# Altium project Fri3D_IRA_02.PrjPcb
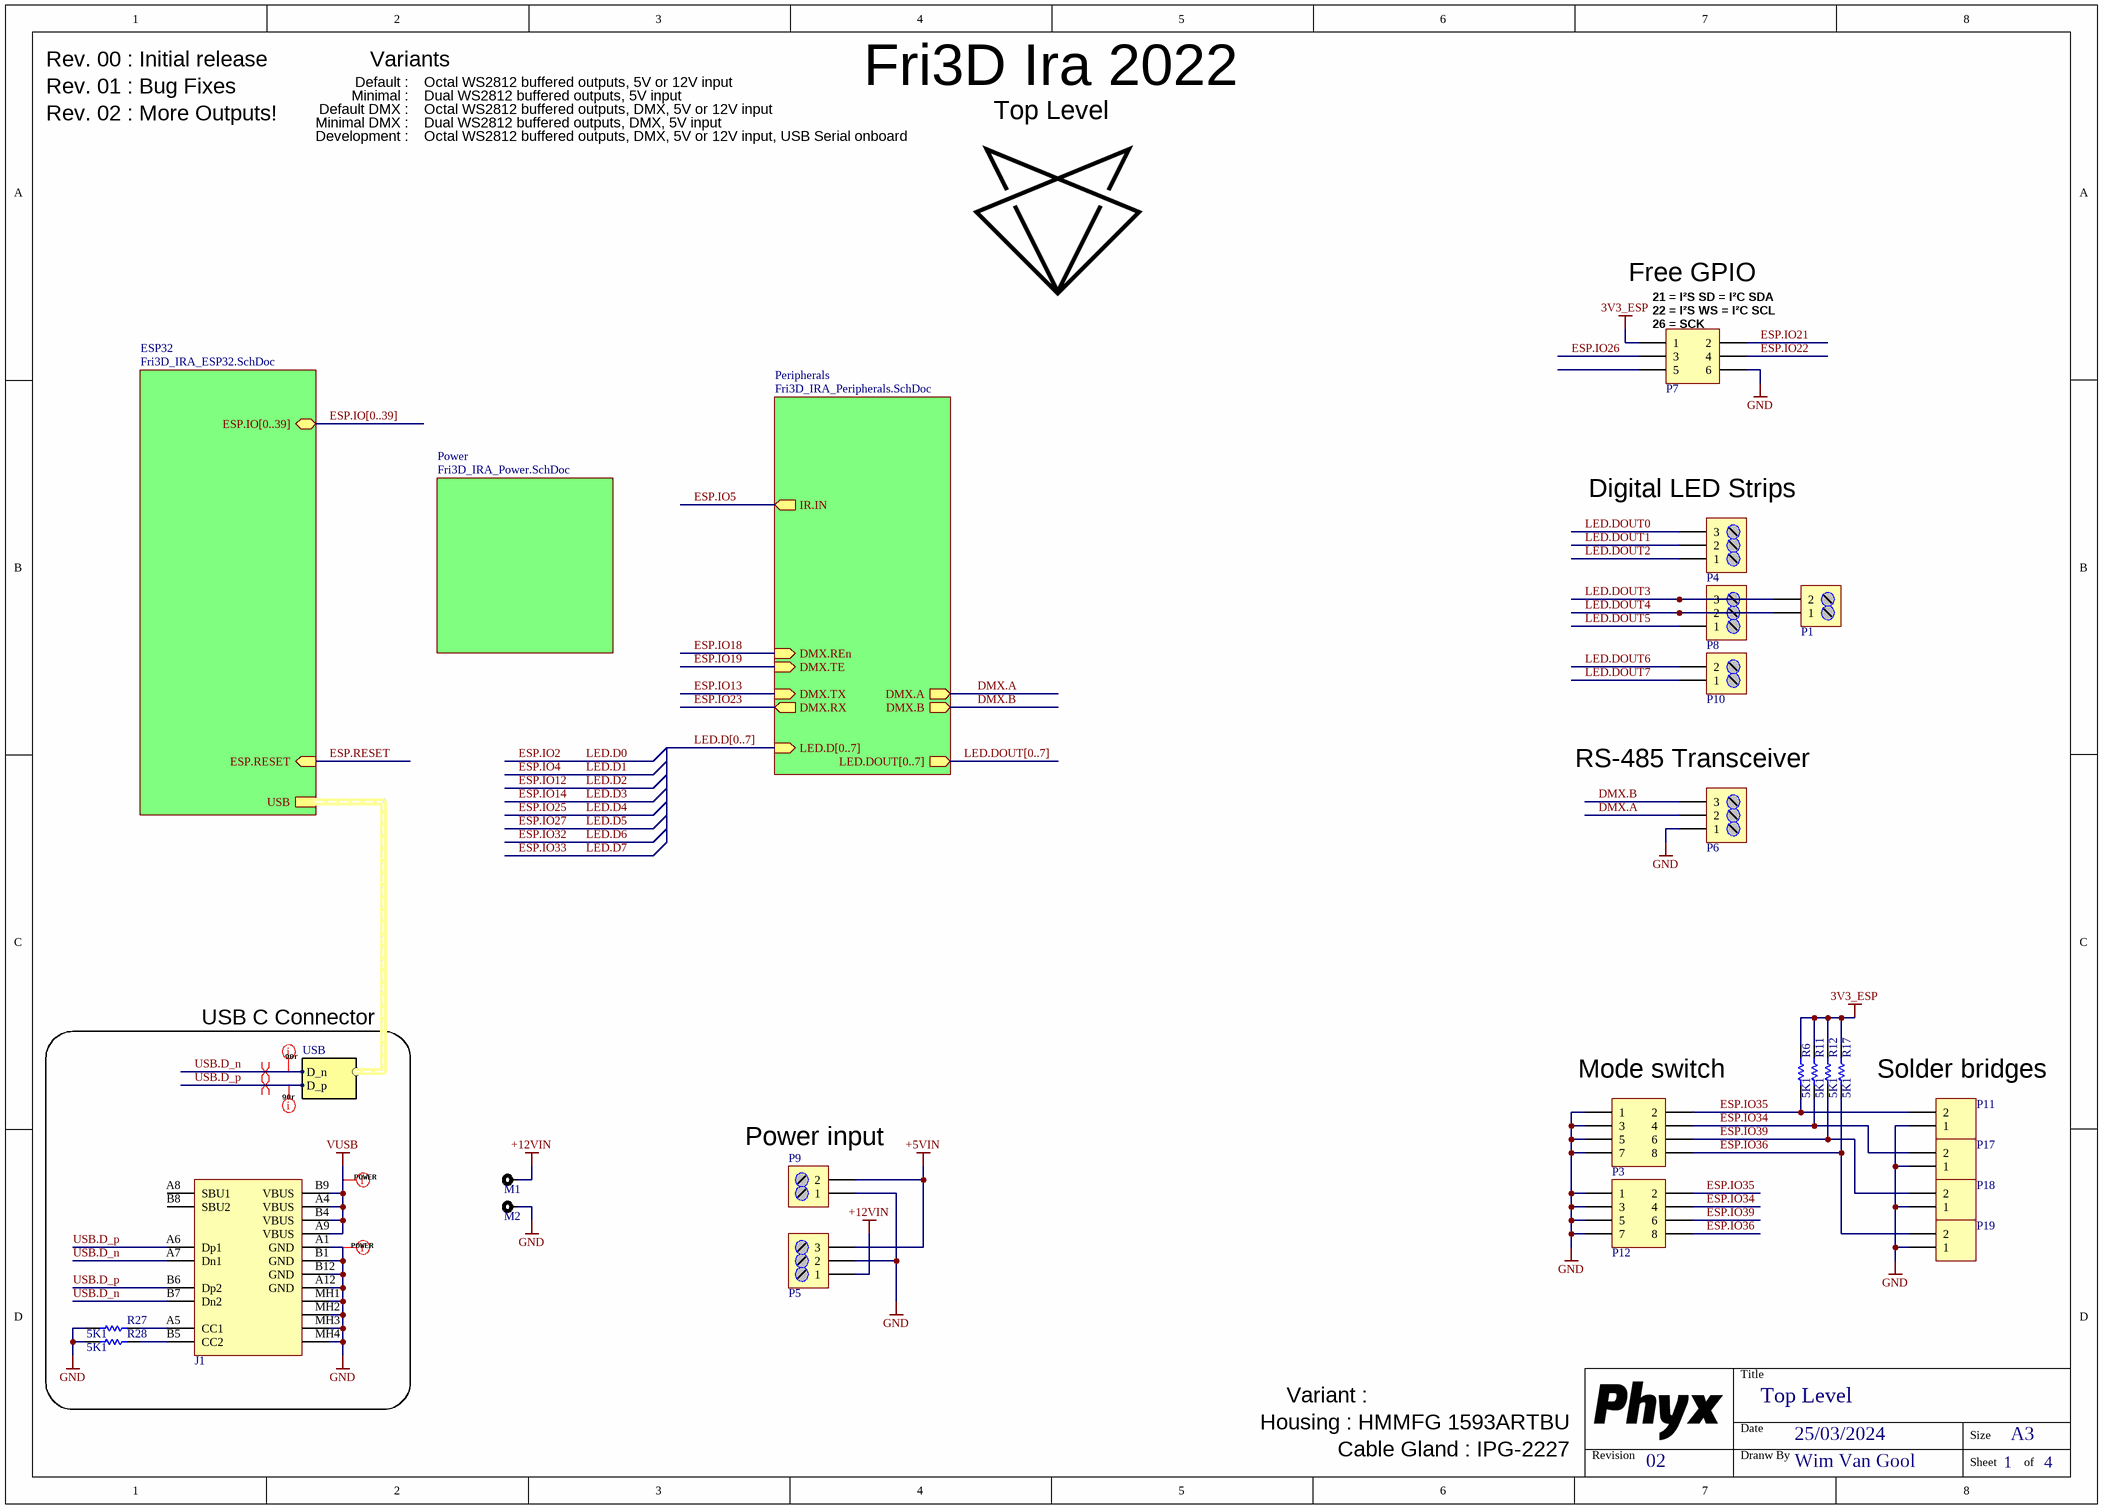
[diagram p0: Fri3D_IRA_02.SchDoc]
PCB_ENGINEER: WimVG; PCB_REV: 02; PCB_TITLE: Fri3D Ira 2022
4 sheets, 98 parts. Net scope: hierarchical (ports join the sheet entries above them; power ports are global).
Board file: Fri3D_IRA_02.PcbDoc
Sheets:
  Fri3D_IRA_02.SchDoc
    Peripherals = Fri3D_IRA_Peripherals.SchDoc
    Power = Fri3D_IRA_Power.SchDoc
    ESP32 = Fri3D_IRA_ESP32.SchDoc

## Sheet Fri3D_IRA_02.SchDoc: Top Level
size A3; Date: 25/03/2024; DrawnBy: Wim Van Gool; DocumentNumber: 1; Revision: 02; SheetNumber: 1; SheetTotal: 4

### Parts
J1  USB 2.0 C Reversible Receptacle Horizontal  [HRO_TYPE-C-31-M-12]  (value not drawn)
M1  SMD Spacer 1mm M3 Internal Thread  [WE_9774010360]  (value not drawn)
M2  SMD Spacer 1mm M3 Internal Thread  [WE_9774010360]  (value not drawn)
P1  2 Way Screw HDR 3.5mm Rising Cage  [WE_691103110002]  (value not drawn)
P3  Header 4x2  [HDR2X4]  (value not drawn)
P4  3 Way Screw HDR 3.5mm Rising Cage  [WE_691103110003]  (value not drawn)
P5  3 Way Screw HDR 5,08mm  [TERM_BLK-0508-3-90]  (value not drawn)
P6  3 Way Screw HDR 3.5mm Rising Cage  [WE_691103110003]  (value not drawn)
P7  Header 3X2  [HDR2X3]  (value not drawn)
P8  3 Way Screw HDR 3.5mm Rising Cage  [WE_691103110003]  (value not drawn)
P9  2 Way Screw HDR 5,08mm  [TERM_BLK-0508-2-90]  (value not drawn)
P10  2 Way Screw HDR 3.5mm Rising Cage  [WE_691103110002]  (value not drawn)
P11  Easy to solder connection  [SOLDER_SW_V_1MM]  (value not drawn)
P12  Header 4X2  [HDR2X4_SMD]  (value not drawn)
P17  Easy to solder connection  [SOLDER_SW_V_1MM]  (value not drawn)
P18  Easy to solder connection  [SOLDER_SW_V_1MM]  (value not drawn)
P19  Easy to solder connection  [SOLDER_SW_V_1MM]  (value not drawn)
R6  value 5K1  [R0603_N]
R11  value 5K1  [R0603_N]
R12  value 5K1  [R0603_N]
R17  value 5K1  [R0603_N]
R27  value 5K1  [R0603_N]
R28  value 5K1  [R0603_N]

### Blocks framed on the sheet
USB C Connector: J1 R27 R28

### Sub-sheets
ESP32 = Fri3D_IRA_ESP32.SchDoc: ESP.RESET (in), ESP.IO[0..39] (bidir), USB (harness USB)
Peripherals = Fri3D_IRA_Peripherals.SchDoc: IR.IN (out), DMX.RX (out), DMX.A (out), DMX.B (out), DMX.TX (in), DMX.REn (in), DMX.TE (in), LED.D[0..7] (in), LED.DOUT[0..7] (out)
Power = Fri3D_IRA_Power.SchDoc: no entries

### Harnesses
USB: D_p, D_n

### Nets
3V3_ESP: P7.1 R6.1 R11.1 R12.1 R17.1
+5VIN: P5.3 P9.2
+12VIN: M1.1 P5.1
GND: J1.A1(GND) J1.A12(GND) J1.B1(GND) J1.B12(GND) J1.MH1(Tab) J1.MH2(Tab) J1.MH3(Tab) J1.MH4(Tab) M2.1 P3.1 P3.3 P3.5 P3.7 P5.2 P6.1 P7.6 P9.1 P11.1 P12.1 P12.3 P12.5 P12.7 P17.1 P18.1 P19.1 R27.2 R28.2
VUSB: J1.A4(VBUS) J1.A9(VBUS) J1.B4(VBUS) J1.B9(VBUS)
DMX.A: P6.2 ; sheet Peripherals/DMX.A
DMX.B: P6.3 ; sheet Peripherals/DMX.B
ESP.IO21: P7.2
ESP.IO22: P7.4
ESP.IO26: P7.3
ESP.IO34: P3.4 P12.4 P17.2 R11.2
ESP.IO35: P3.2 P11.2 P12.2 R6.2
ESP.IO36: P3.8 P12.8 P19.2 R17.2
ESP.IO39: P3.6 P12.6 P18.2 R12.2
LED.DOUT0: P4.3
LED.DOUT1: P4.2
LED.DOUT2: P4.1
LED.DOUT3: P1.2 P8.3
LED.DOUT4: P1.1 P8.2
LED.DOUT5: P8.1
LED.DOUT6: P10.2
LED.DOUT7: P10.1
USB.D_n: J1.A7(Dn1) J1.B7(Dn2) ; sheet ESP32/USB.D_n
USB.D_p: J1.A6(Dp1) J1.B6(Dp2) ; sheet ESP32/USB.D_p
NetJ1_A5: J1.A5(CC1) R27.1
NetJ1_B5: J1.B5(CC2) R28.1

Not connected (* = marked no-connect by the designer): J1 A8(SBU1) B8(SBU2); P7 5

### Buses and harness runs
bus ESP.IO[0..39] = sheet ESP32/ESP.IO[0..39]
bus LED.D[0..7] = sheet Peripherals/LED.D[0..7]
bus LED.DOUT[0..7] = sheet Peripherals/LED.DOUT[0..7]

### Layout directives
net class 90r: USB.D_n, USB.D_p
differential pair: USB.D_n, USB.D_p
net class POWER: GND, VUSB

### Notes on the sheet
- Rev. 00 : Initial release
- Variants
- Rev. 01 : Bug Fixes
- Rev. 02 : More Outputs!
- Default :
- Minimal :
- Minimal DMX :
- Default DMX :
- Octal WS2812 buffered outputs, 5V or 12V input
- Dual WS2812 buffered outputs, 5V input
- Dual WS2812 buffered outputs, DMX, 5V input
- Octal WS2812 buffered outputs, DMX, 5V or 12V input
- Development :
- Octal WS2812 buffered outputs, DMX, 5V or 12V input, USB Serial onboard
- (near P7) 22 = I²S WS = I²C SCL
- (near P7) 26 = SCK
- (near P7) 21 = I²S SD = I²C SDA
- Free GPIO
- (near P4) Digital LED Strips
- (near P6) RS-485 Transceiver
- (near P3) Mode switch
- Solder bridges
- (near P9) Power input
- Variant :
- Housing : HMMFG 1593ARTBU
- Cable Gland : IPG-2227
- Title
- Revision
- Date
- Dranw By
- Size
- A3
- Sheet
- of

### Library data of the parts
J1 = USB # C 2.0 RCPT TYPE-C-31-M-12: Value: TYPE-C-31-M-12; Supplier 1: China; Supplier Part Number 1: HRO TYPE-C-31-M-12; Supplier 2: LCSC; Supplier Part Number 2: C165948; Supplier 3: LCSC ALT; Supplier Part Number 3: C167321 / C319148
M1 M2 = SPACER # M3 1mm: Screw Hole; Value: 9774010360; Supplier 1: Wurth; Supplier Part Number 1: 9774010360
P1 P10 = Terminal Block 3.5mm 2way: Supplier 1: LCSC; Supplier Part Number 1: C784940; Supplier 2: Würth; Supplier Part Number 2: 691214110002
P3 = Pin Header 2.54mm dual row 8way
P4 P6 P8 = Terminal Block 3.5mm 3way: Supplier 1: LCSC; Supplier Part Number 1: C784941; Supplier 2: Würth; Supplier Part Number 2: 691214110003
P5 = Terminal Block 5.08mm 3way: Value: PM5.08/3/90; Supplier 1: Farnell
P7 = Pin Header 2.54mm dual row 6way
P9 = Terminal Block 5.08mm 2way: Value: PM5.08/2/90; Supplier 1: Farnell; Supplier Part Number 1: 1131853; Supplier 2: LCSC; Supplier Part Number 2: C8465
P11 P17-P19 = SOLDER SW V 1MM: Value: NO BOM
P12 = Pin Header # 2.54mm dual row 8way: Supplier 1: LCSC; Supplier Part Number 1: C192300; Description: Pin Header # 2.54mm dual row 8way
R6 R11 R12 R17 R27 R28 = RES # 5K1 0603: Supplier 1: Farnell; Supplier Part Number 1: 2845922; Supplier 2: LCSC; Supplier 3: Generic; Supplier Part Number 2: C112314; Supplier Part Number 3: 5K1 1% 0603

## Sheet Fri3D_IRA_Peripherals.SchDoc: Peripherals
size A3; Date: 25/03/2024; DrawnBy: Wim Van Gool; DocumentNumber: 3; Revision: 02; SheetNumber: 3; SheetTotal: 4
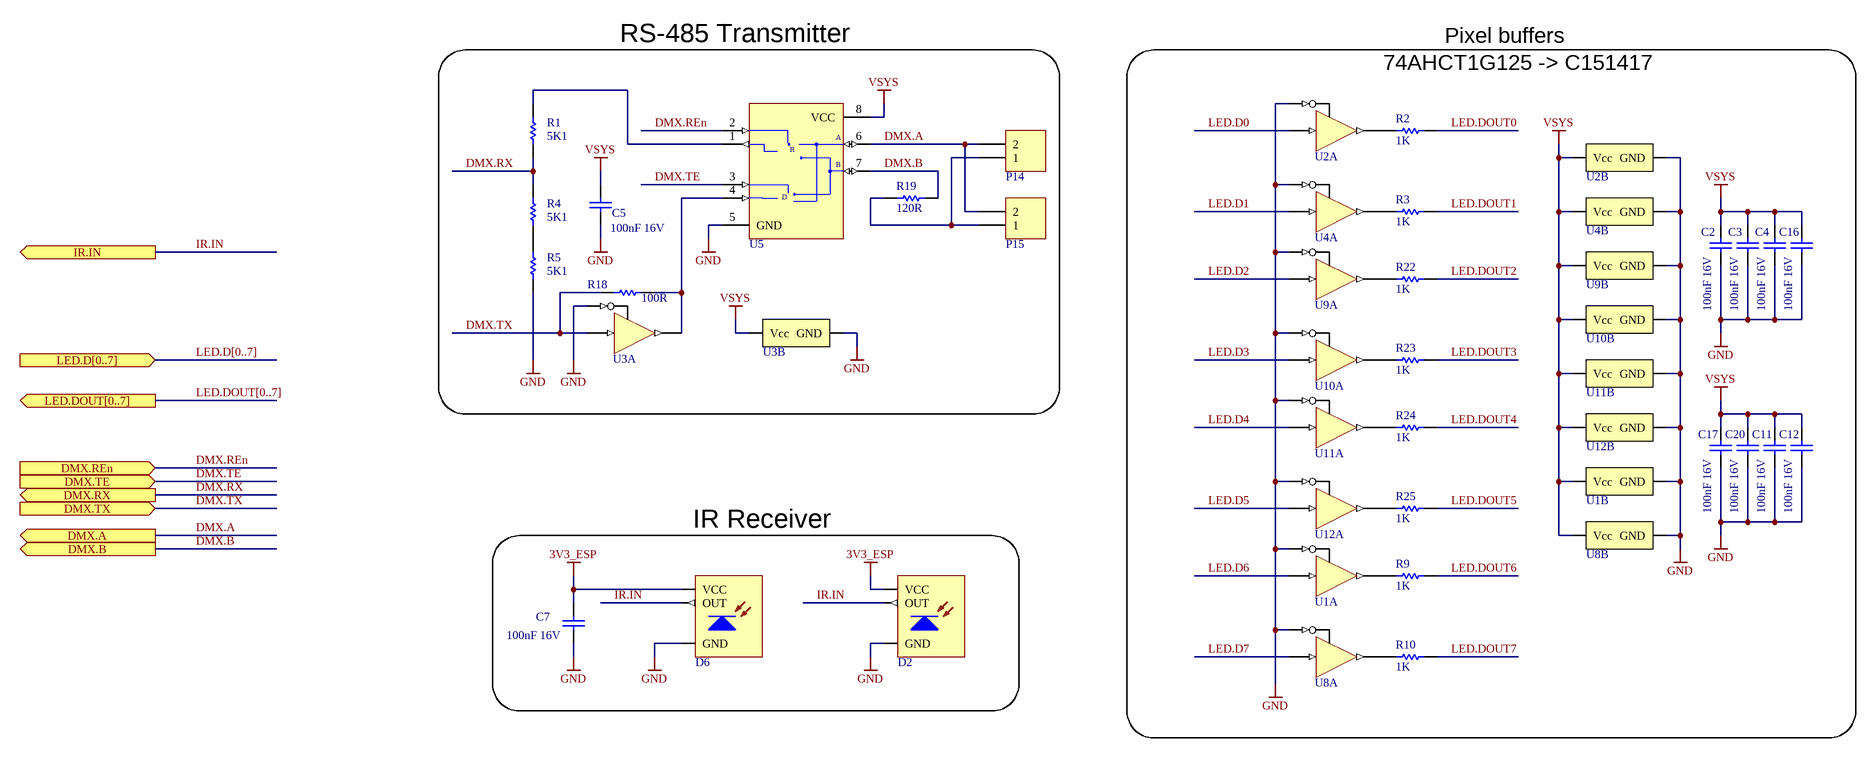
[diagram p1: Fri3D_IRA_Peripherals.SchDoc]

### Parts
C2  value 100nF 16V  [C0603_N]
C3  value 100nF 16V  [C0603_N]
C4  value 100nF 16V  [C0603_N]
C5  value 100nF 16V  [C0603_N]
C7  value 100nF 16V  [C0603_N]
C11  value 100nF 16V  [C0603_N]
C12  value 100nF 16V  [C0603_N]
C16  value 100nF 16V  [C0603_N]
C17  value 100nF 16V  [C0603_N]
C20  value 100nF 16V  [C0603_N]
D2  ZIRM-5042B-42-Z2 Infrared Receiver 38 kHz 45° 2.7-5.5V 940nm  [CHAU_ZIRM-5042B-42-Z2]  (value not drawn)
D6  IRM-3638N3F14 Infrared Receiver 38 kHz 45° 2.7-5.5V  [VIS_TSOP381x_BENT]  (value not drawn)
P14  Easy to solder connection  [SOLDER_SW_V_1MM]  (value not drawn)
P15  Header 2  [HDR1X2]  (value not drawn)
R1  value 5K1  [R0603_N]
R2  value 1K  [R0603_N]
R3  value 1K  [R0603_N]
R4  value 5K1  [R0603_N]
R5  value 5K1  [R0603_N]
R9  value 1K  [R0603_N]
R10  value 1K  [R0603_N]
R18  value 100R  [R0603_N]
R19  value 120R  [R1206]
R22  value 1K  [R0603_N]
R23  value 1K  [R0603_N]
R24  value 1K  [R0603_N]
R25  value 1K  [R0603_N]
U1  SN74AHCT1G125DCKR  Buffer, Tri-State, 4.5V to 5.5V  [TI_DCK_R-PDSO-G5]  (value not drawn)  (parts A,B of 2)
U2  SN74AHCT1G125DCKR  Buffer, Tri-State, 4.5V to 5.5V  [TI_DCK_R-PDSO-G5]  (value not drawn)  (parts A,B of 2)
U3  SN74AHCT1G125DCKR  Buffer, Tri-State, 4.5V to 5.5V  [TI_DCK_R-PDSO-G5]  (value not drawn)  (parts A,B of 2)
U4  SN74AHCT1G125DCKR  Buffer, Tri-State, 4.5V to 5.5V  [TI_DCK_R-PDSO-G5]  (value not drawn)  (parts A,B of 2)
U5  RS-485 5V Transceiver 500kbps  [SOIC_N_8]  (value not drawn)
U8  SN74AHCT1G125DCKR  Buffer, Tri-State, 4.5V to 5.5V  [TI_DCK_R-PDSO-G5]  (value not drawn)  (parts A,B of 2)
U9  SN74AHCT1G125DCKR  Buffer, Tri-State, 4.5V to 5.5V  [TI_DCK_R-PDSO-G5]  (value not drawn)  (parts A,B of 2)
U10  SN74AHCT1G125DCKR  Buffer, Tri-State, 4.5V to 5.5V  [TI_DCK_R-PDSO-G5]  (value not drawn)  (parts A,B of 2)
U11  SN74AHCT1G125DCKR  Buffer, Tri-State, 4.5V to 5.5V  [TI_DCK_R-PDSO-G5]  (value not drawn)  (parts A,B of 2)
U12  SN74AHCT1G125DCKR  Buffer, Tri-State, 4.5V to 5.5V  [TI_DCK_R-PDSO-G5]  (value not drawn)  (parts A,B of 2)

### Blocks framed on the sheet
RS-485 Transmitter: C5 P14 P15 R1 R4 R5 R18 R19 U3 U5
IR Receiver: C7 D2 D6

### Ports
DMX.A (out), DMX.B (out), DMX.REn (in), DMX.RX (out), DMX.TE (in), DMX.TX (in), IR.IN (out), LED.D[0..7] (in), LED.DOUT[0..7] (out)

### Nets
3V3_ESP: C7.1 D2.3(VCC) D6.3(VCC)
GND: C2.2 C3.2 C4.2 C5.2 C7.2 C11.2 C12.2 C16.2 C17.2 C20.2 D2.2(GND) D6.2(GND) R5.2 U1.1(~{OE}) U1.3(GND) U2.1(~{OE}) U2.3(GND) U3.1(~{OE}) U3.3(GND) U4.1(~{OE}) U4.3(GND) U5.5(GND) U8.1(~{OE}) U8.3(GND) U9.1(~{OE}) U9.3(GND) U10.1(~{OE}) U10.3(GND) U11.1(~{OE}) U11.3(GND) U12.1(~{OE}) U12.3(GND)
VSYS: C2.1 C3.1 C4.1 C5.1 C11.1 C12.1 C16.1 C17.1 C20.1 U1.5(Vcc) U2.5(Vcc) U3.5(Vcc) U4.5(Vcc) U5.8(VCC) U8.5(Vcc) U9.5(Vcc) U10.5(Vcc) U11.5(Vcc) U12.5(Vcc)
DMX.A: P14.2 P15.2 U5.6(A) ; port DMX.A
DMX.B: R19.2 U5.7(B) ; port DMX.B
DMX.REn: U5.2(~{RE}) ; port DMX.REn
DMX.RX: R1.2 R4.1 ; port DMX.RX
DMX.TE: U5.3(DE) ; port DMX.TE
DMX.TX: R18.1 U3.2(A) ; port DMX.TX
IR.IN: D2.1(OUT) D6.1(OUT) ; port IR.IN  [project net ESP.IO5]
LED.D0: U2.2(A)  [project net ESP.IO2]
LED.D1: U4.2(A)  [project net ESP.IO4]
LED.D2: U9.2(A)  [project net ESP.IO12]
LED.D3: U10.2(A)  [project net ESP.IO14]
LED.D4: U11.2(A)  [project net ESP.IO25]
LED.D5: U12.2(A)  [project net ESP.IO27]
LED.D6: U1.2(A)  [project net ESP.IO32]
LED.D7: U8.2(A)  [project net ESP.IO33]
LED.DOUT0: R2.2
LED.DOUT1: R3.2
LED.DOUT2: R22.2
LED.DOUT3: R23.2
LED.DOUT4: R24.2
LED.DOUT5: R25.2
LED.DOUT6: R9.2
LED.DOUT7: R10.2
NetP14_1: P14.1 P15.1 R19.1
NetR1_1: R1.1 U5.1(RO)
NetR2_1: R2.1 U2.4(Y)
NetR3_1: R3.1 U4.4(Y)
NetR4_2: R4.2 R5.1
NetR9_1: R9.1 U1.4(Y)
NetR10_1: R10.1 U8.4(Y)
NetR18_2: R18.2 U3.4(Y) U5.4(DI)
NetR22_1: R22.1 U9.4(Y)
NetR23_1: R23.1 U10.4(Y)
NetR24_1: R24.1 U11.4(Y)
NetR25_1: R25.1 U12.4(Y)

### Buses and harness runs
bus LED.D[0..7] = port LED.D[0..7]
bus LED.DOUT[0..7] = port LED.DOUT[0..7]

### Notes on the sheet
- Pixel buffers
- 74AHCT1G125 -> C151417
- Title
- Revision
- Date
- Dranw By
- Size
- A3
- Sheet
- of
- (in symbol WS3085 # RS-485 transceiver) R; D

### Library data of the parts
C2-C5 C7 C11 C12 C16 C17 C20 = CAP # 100nF 16V 0603: Capacitor Ceramic; Supplier 1: LCSC; Supplier 3: Generic; Supplier Part Number 1: C282519; Supplier Part Number 3: 100nF 16V 0603 X7R
D2 = PHO IR Rx 940nm ZIRM-5042B-42-Z2: =Description; Value: ZIRM-5042B-42-Z2; Supplier 1: LCSC; Supplier Part Number 1: C575386
D6 = PHO IR Rx RA: =Description; Value: IRM-3638N3F14; Supplier 1: LCSC; Supplier Part Number 1: C264262
P14 = SOLDER SW V 1MM: Value: NO BOM
P15 = Pin Header 2.54mm 2way: Supplier 1: LCSC; Supplier 2: LCSC; Supplier Part Number 1: C492401; Supplier Part Number 2: C541856
R1 R4 R5 = RES # 5K1 0603: Supplier 1: Farnell; Supplier Part Number 1: 2845922; Supplier 2: LCSC; Supplier 3: Generic; Supplier Part Number 2: C112314; Supplier Part Number 3: 5K1 1% 0603
R2 R3 R9 R10 R22-R25 = RES # 1K 0603: Supplier 1: Farnell; Supplier Part Number 1: 2689409; Supplier 2: LCSC; Supplier Part Number 2: C21190; Supplier 3: Generic; Supplier Part Number 3: 1K 1% 0603
R18 = RES # 100R 0603: Supplier 1: Farnell; Supplier 2: LCSC; Supplier 3: Generic; Supplier Part Number 1: 2446544; Supplier Part Number 2: C22775; Supplier Part Number 3: 100R 1% 0603
R19 = RES # 120R 1206: Supplier 3: Generic; Supplier Part Number 3: 120R 1% 1206; Supplier 1: LCSC; Supplier Part Number 1: C17909
U1-U4 U8-U12 = BUF # 1 SN74AHCT1G125DCKR: =Description; Value: SN74AHCT1G125DCKR; Supplier 1: LCSC; Supplier Part Number 1: C151417; Supplier 2: LCSC; Supplier Part Number 2: C350557
U5 = WS3085 # RS-485 transceiver: Value: WS3085; Supplier 1: LCSC; Supplier Part Number 1: C2691412; Description: WS3085 # RS-485 transceiver

## Sheet Fri3D_IRA_Power.SchDoc: Power
size A3; Date: 25/03/2024; DrawnBy: Wim Van Gool; DocumentNumber: 4; Revision: 02; SheetNumber: 4; SheetTotal: 4
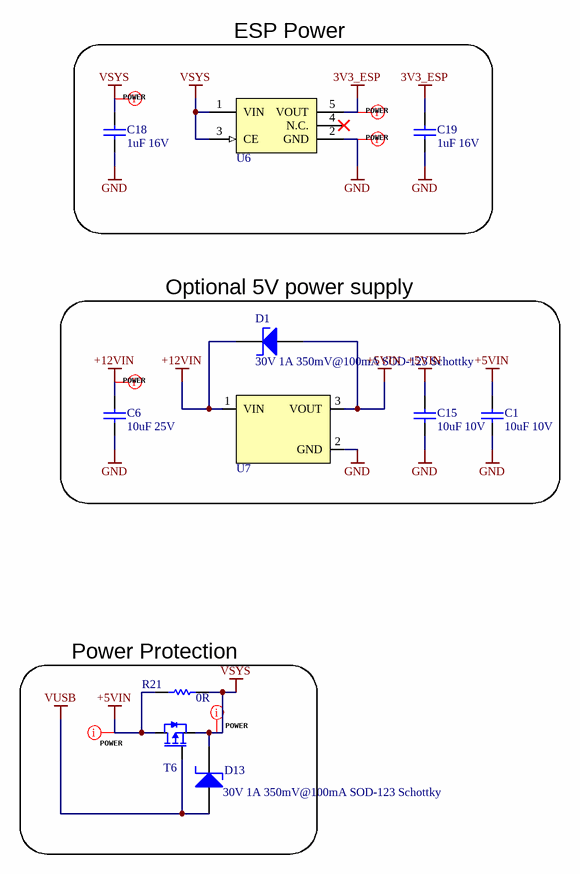
[diagram p2: Fri3D_IRA_Power.SchDoc]

### Parts
C1  value 10uF 10V  [C0805_N]  (hidden comment: CAP_CERAMIC)
C6  value 10uF 25V  [C0805_N]
C15  value 10uF 10V  [C0805_N]  (hidden comment: CAP_CERAMIC)
C18  value 1uF 16V  [C0603_N]
C19  value 1uF 16V  [C0603_N]
D1  30V 1A 350mV@100mA SOD-123 Schottky  [ON_SOD-123FL_AC]
D13  30V 1A 350mV@100mA SOD-123 Schottky  [ON_SOD-123FL_AC]
R21  value 0R  [R0603_N]
T6  -2.3A -20V P-Ch MOSFET Vgs -1V  [SOT23-3]  (value not drawn)
U6  3V3 LDO 700mA 50mV  [SOT23-5]  (value not drawn)
U7  Mornsun K7805-500R3-LB 5V 500mA 4.75~36Vin  [K78xx-500R3-LB]  (value not drawn)

### Blocks framed on the sheet
ESP Power: C18 C19 U6
Optional 5V power supply: C1 C6 C15 D1 U7
Power Protection: D13 R21 T6

### Nets
3V3_ESP: C19.1 U6.5(VOUT)
+5VIN: C1.1 C15.1 D1.A R21.2 T6.3(D) U7.3(VOUT)
+12VIN: C6.1 D1.C U7.1(VIN)
GND: C1.2 C6.2 C15.2 C18.2 C19.2 U6.2(GND) U7.2(GND)
VSYS: C18.1 D13.C R21.1 T6.2(S) U6.1(VIN) U6.3(CE)
VUSB: D13.A T6.1(G)

Not connected (* = marked no-connect by the designer): U6 4(N.C.)*

### Layout directives
net class POWER: 3V3_ESP, +5VIN, +12VIN, GND, VSYS

### Notes on the sheet
- Title
- Revision
- Date
- Dranw By
- Size
- A3
- Sheet
- of

### Library data of the parts
C1 C15 = CAP # 10uF 10V 0805: Capacitor Ceramic; Supplier 1: Farnell; Supplier Part Number 1: 2320859; Supplier 3: Generic; Supplier Part Number 3: 10uF 10V 0805 X7R; Description: CAP # 10uF 10V 0805; Supplier 2: LCSC; Supplier Part Number 2: C17024
C6 = CAP # 10uF 25V 0805: Capacitor Ceramic; Supplier 1: LCSC; Supplier Part Number 1: C237493; Supplier 3: Generic; Supplier Part Number 3: 10uF 25V 0805 X7R
C18 C19 = CAP # 1uF 16V 0603: Capacitor Ceramic; Supplier 1: Farnell; Supplier Part Number 1: 2320814; Supplier 2: LCSC; Supplier 3: Generic; Supplier Part Number 2: C1592; Supplier Part Number 3: 1uF 16V 0603 X7R
D1 D13 = Schottky # LMBR130T1G: =Description; Supplier 1: LCSC; Supplier Part Number 1: C48974; Value: LMBR130T1G; Description: Schottky # LMBR130T1G; Supplier 2: LCSC; Supplier Part Number 2: C917121
R21 = RES # 0R 0603: Supplier 1: Farnell; Supplier Part Number 1: 2447743; Supplier 3: Generic; Supplier Part Number 3: 0R 1% 0603; Supplier 2: LCSC; Supplier Part Number 2: C95177 / C15402
T6 = SL2301 P-Ch MOSFET -2.3A -20Vds: =Description; Value: SL2301; Supplier 1: LCSC; Supplier Part Number 1: C181086
U6 = LDO # 3V3 XC6210B33: =Designator; Value: XC6210B332MR; Supplier 1: Farnell; Supplier Part Number 1: 1057803; Supplier 2: LCSC; Supplier Part Number 2: C47719
U7 = PWR MOD Buck 5V K7805-500R3-LB: =Designator; Value: K7805-500R3-LB; Supplier 1: Digi-key; Supplier Part Number 1: 2725-K7805-500R3-LB-ND; Supplier 2: LCSC; Supplier Part Number 2: C5198056

## Sheet Fri3D_IRA_ESP32.SchDoc: ESP32 Module
size A3; Date: 25/03/2024; DrawnBy: Wim Van Gool; DocumentNumber: 2; Revision: 02; SheetNumber: 2; SheetTotal: 4
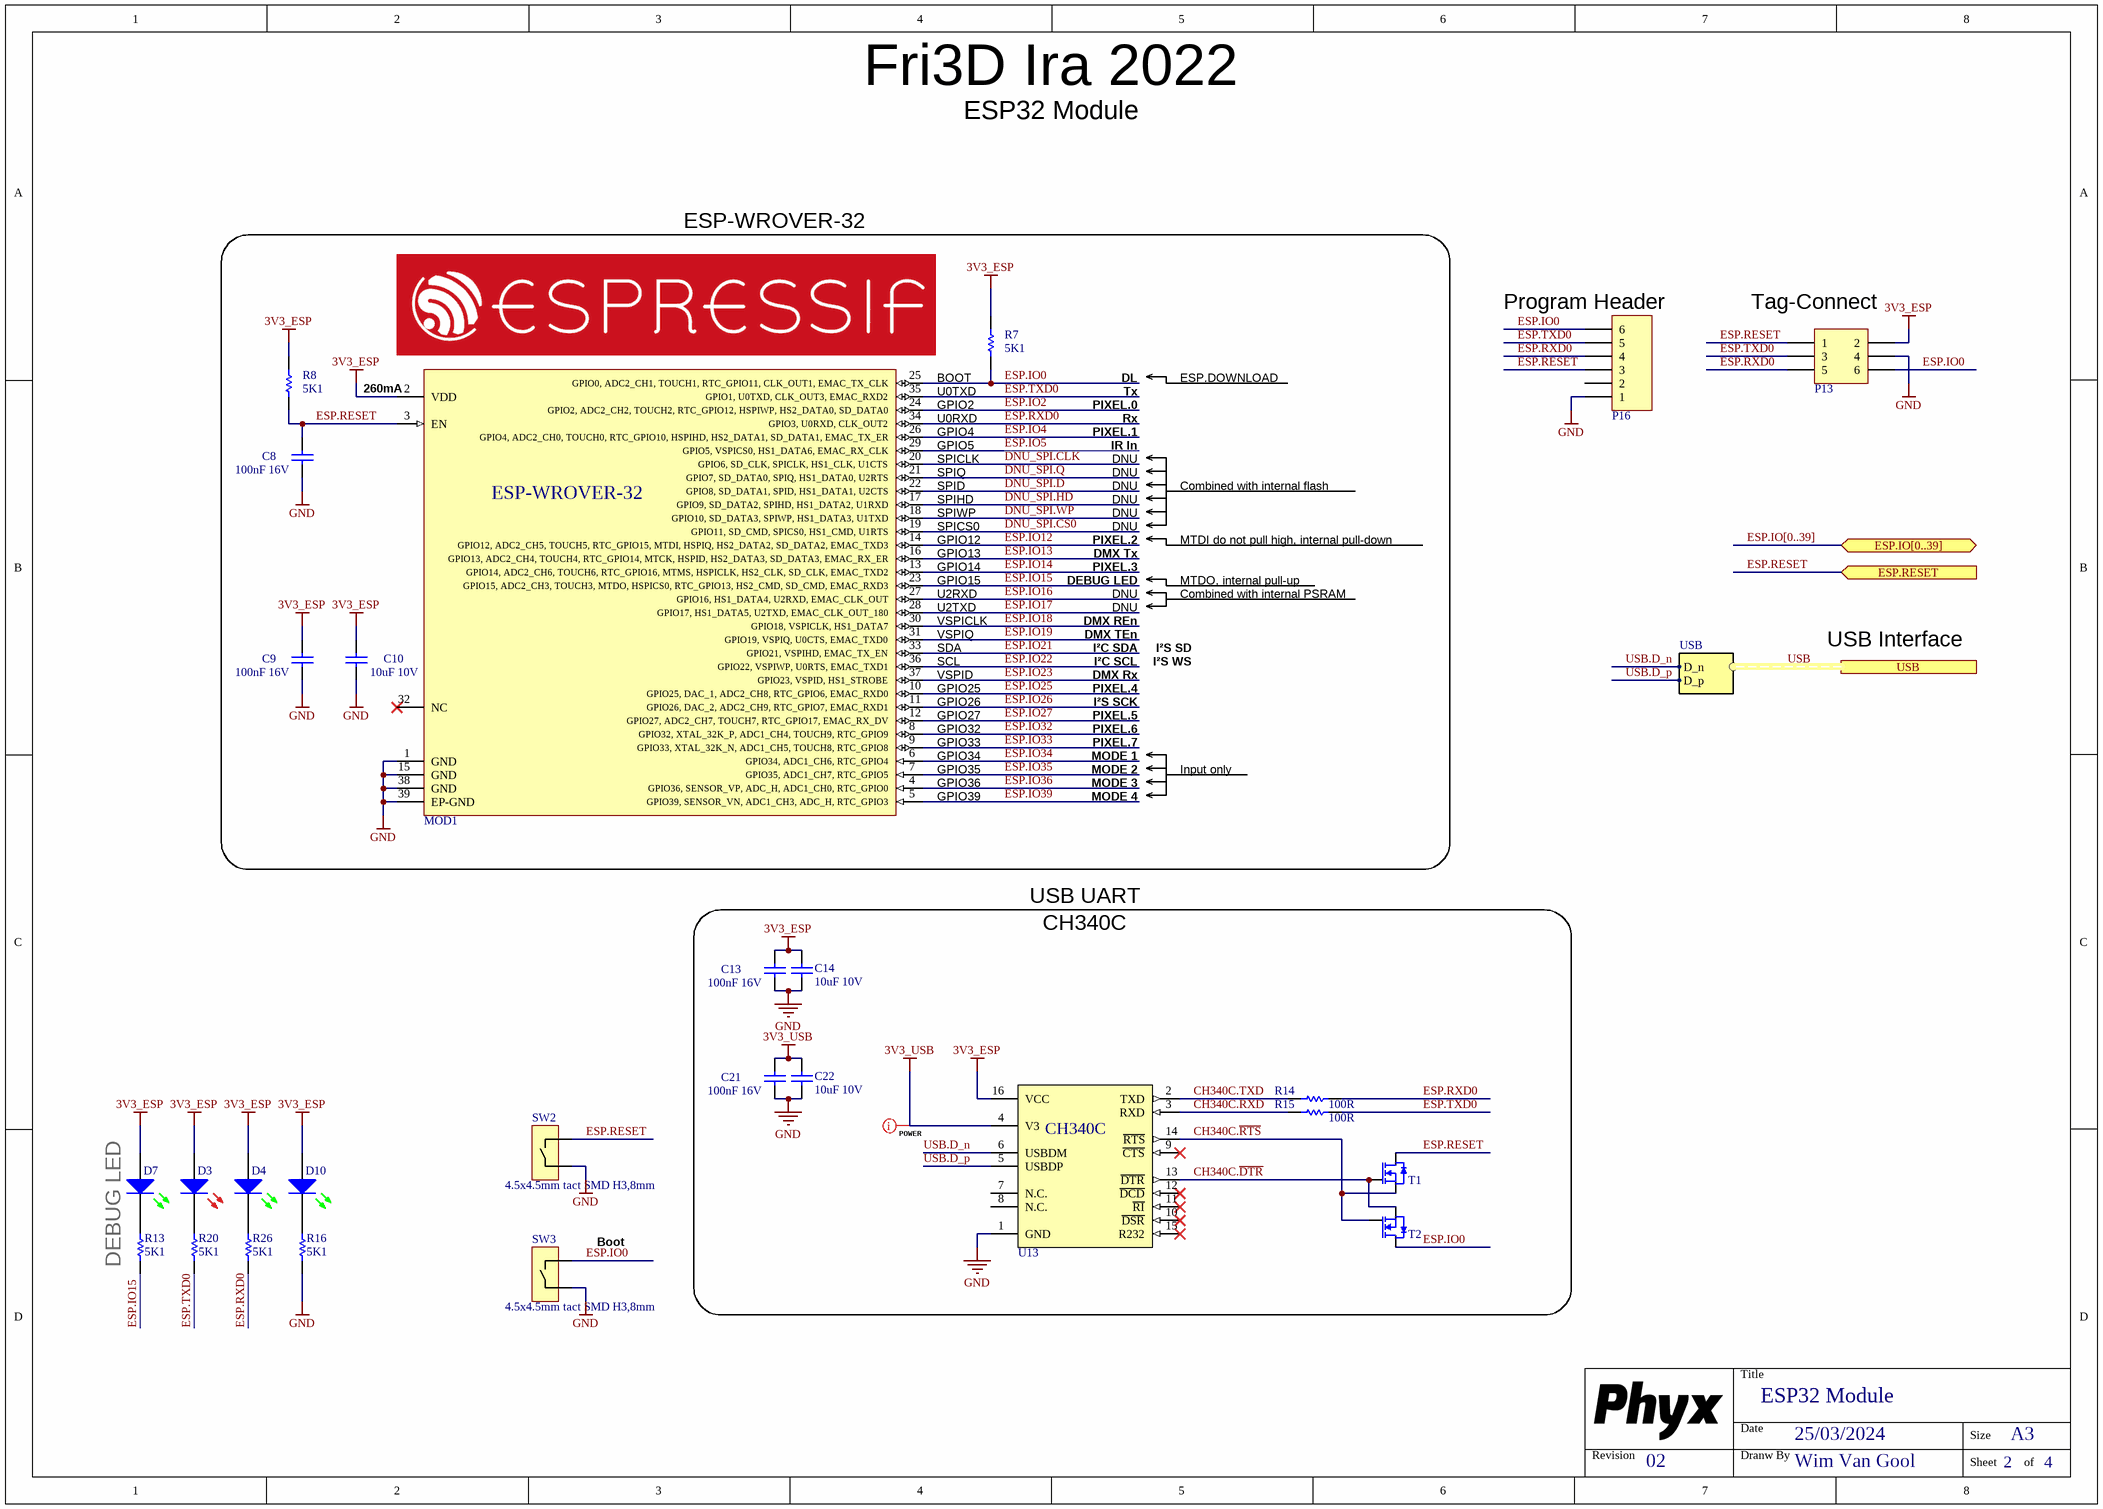
[diagram p3: Fri3D_IRA_ESP32.SchDoc]

### Parts
C8  value 100nF 16V  [C0603_N]
C9  value 100nF 16V  [C0603_N]
C10  value 10uF 10V  [C0805_N]
C13  value 100nF 16V  [C0603_N]
C14  value 10uF 10V  [C0805_N]
C21  value 100nF 16V  [C0603_N]
C22  value 10uF 10V  [C0805_N]
D3  Default 0805 Red LED  [LED_0805_RD]  (value not drawn)
D4  Default 0805 Green LED  [LED_0805_GR]  (value not drawn)
D7  Default 0805 Green LED  [LED_0805_GR]  (value not drawn)
D10  Default 0805 Green LED  [LED_0805_GR]  (value not drawn)
MOD1  ESP-32 based ESP-WROVER-32  [ESP-WROVER-32]  (value not drawn)
P13  6 pin tagconnect TC2030  [TC2030]  (value not drawn)
P16  Header 6  [HDR1X6]  (value not drawn)
R7  value 5K1  [R0603_N]
R8  value 5K1  [R0603_N]
R13  value 5K1  [R0603_N]
R14  value 100R  [R0603_N]
R15  value 100R  [R0603_N]
R16  value 5K1  [R0603_N]
R20  value 5K1  [R0603_N]
R26  value 5K1  [R0603_N]
SW2  4.5x4.5mm tact SMD H3,8mm  [WE_430181038816]
SW3  4.5x4.5mm tact SMD H3,8mm  [WE_430181038816]
T1  0.2A N-Ch MOSFET Vgs 3.2  [SOT23-3]  (value not drawn)
T2  0.2A N-Ch MOSFET Vgs 3.2  [SOT23-3]  (value not drawn)
U13  USB to full UART with internal crystal  [SOIC_N_16]  (value not drawn)

### Blocks framed on the sheet
ESP-WROVER-32: C8-C10 MOD1 R7 R8

### Ports
ESP.IO[0..39] (bidir), ESP.RESET (in), USB (harness USB)

### Harnesses
USB: D_p, D_n

### Nets
3V3_ESP: C9.1 C10.1 C13.1 C14.2 D3.1(A) D4.1(A) D7.1(A) D10.1(A) MOD1.2(VDD) P13.2 R7.1 R8.1 U13.16(VCC)
3V3_USB: C21.1 C22.2 U13.4(V3)
GND: C8.2 C9.2 C10.2 C13.2 C14.1 C21.2 C22.1 MOD1.1(GND) MOD1.15(GND) MOD1.38(GND) MOD1.39(EP-GND) P13.4 P16.1 R16.2 SW2.2 SW3.2 U13.1(GND)
CH340C.~{DTR}: T1.1(G) T2.2(S) U13.13(~{DTR})
CH340C.~{RTS}: T1.2(S) T2.1(G) U13.14(~{RTS})
CH340C.RXD: R15.1 U13.3(RXD)
CH340C.TXD: R14.1 U13.2(TXD)
DNU_SPI.CLK: MOD1.20(GPIO6,_SD_CLK,_SPICLK,_HS1_CLK,_U1CTS)
DNU_SPI.CS0: MOD1.19(GPIO11,_SD_CMD,_SPICS0,_HS1_CMD,_U1RTS)
DNU_SPI.D: MOD1.22(GPIO8,_SD_DATA1,_SPID,_HS1_DATA1,_U2CTS)
DNU_SPI.HD: MOD1.17(GPIO9,_SD_DATA2,_SPIHD,_HS1_DATA2,_U1RXD)
DNU_SPI.Q: MOD1.21(GPIO7,_SD_DATA0,_SPIQ,_HS1_DATA0,_U2RTS)
DNU_SPI.WP: MOD1.18(GPIO10,_SD_DATA3,_SPIWP,_HS1_DATA3,_U1TXD)
ESP.IO0: MOD1.25(GPIO0,_ADC2_CH1,_TOUCH1,_RTC_GPIO11,_CLK_OUT1,_EMAC_TX_CLK) P13.6 P16.6 R7.2 SW3.1 T2.3(D)
ESP.IO2: MOD1.24(GPIO2,_ADC2_CH2,_TOUCH2,_RTC_GPIO12,_HSPIWP,_HS2_DATA0,_SD_DATA0)
ESP.IO4: MOD1.26(GPIO4,_ADC2_CH0,_TOUCH0,_RTC_GPIO10,_HSPIHD,_HS2_DATA1,_SD_DATA1,_EMAC_TX_ER)
ESP.IO5: MOD1.29(GPIO5,_VSPICS0,_HS1_DATA6,_EMAC_RX_CLK)
ESP.IO12: MOD1.14(GPIO12,_ADC2_CH5,_TOUCH5,_RTC_GPIO15,_MTDI,_HSPIQ,_HS2_DATA2,_SD_DATA2,_EMAC_TXD3)
ESP.IO13: MOD1.16(GPIO13,_ADC2_CH4,_TOUCH4,_RTC_GPIO14,_MTCK,_HSPID,_HS2_DATA3,_SD_DATA3,_EMAC_RX_ER)  [project net DMX.TX]
ESP.IO14: MOD1.13(GPIO14,_ADC2_CH6,_TOUCH6,_RTC_GPIO16,_MTMS,_HSPICLK,_HS2_CLK,_SD_CLK,_EMAC_TXD2)
ESP.IO15: MOD1.23(GPIO15,_ADC2_CH3,_TOUCH3,_MTDO,_HSPICS0,_RTC_GPIO13,_HS2_CMD,_SD_CMD,_EMAC_RXD3) R13.2
ESP.IO16: MOD1.27(GPIO16,_HS1_DATA4,_U2RXD,_EMAC_CLK_OUT)
ESP.IO17: MOD1.28(GPIO17,_HS1_DATA5,_U2TXD,_EMAC_CLK_OUT_180)
ESP.IO18: MOD1.30(GPIO18,_VSPICLK,_HS1_DATA7)  [project net DMX.REn]
ESP.IO19: MOD1.31(GPIO19,_VSPIQ,_U0CTS,_EMAC_TXD0)  [project net DMX.TE]
ESP.IO21: MOD1.33(GPIO21,_VSPIHD,_EMAC_TX_EN)
ESP.IO22: MOD1.36(GPIO22,_VSPIWP,_U0RTS,_EMAC_TXD1)
ESP.IO23: MOD1.37(GPIO23,_VSPID,_HS1_STROBE)  [project net DMX.RX]
ESP.IO25: MOD1.10(GPIO25,_DAC_1,_ADC2_CH8,_RTC_GPIO6,_EMAC_RXD0)
ESP.IO26: MOD1.11(GPIO26,_DAC_2,_ADC2_CH9,_RTC_GPIO7,_EMAC_RXD1)
ESP.IO27: MOD1.12(GPIO27,_ADC2_CH7,_TOUCH7,_RTC_GPIO17,_EMAC_RX_DV)
ESP.IO32: MOD1.8(GPIO32,_XTAL_32K_P,_ADC1_CH4,_TOUCH9,_RTC_GPIO9)
ESP.IO33: MOD1.9(GPIO33,_XTAL_32K_N,_ADC1_CH5,_TOUCH8,_RTC_GPIO8)
ESP.IO34: MOD1.6(GPIO34,_ADC1_CH6,_RTC_GPIO4)
ESP.IO35: MOD1.7(GPIO35,_ADC1_CH7,_RTC_GPIO5)
ESP.IO36: MOD1.4(GPIO36,_SENSOR_VP,_ADC_H,_ADC1_CH0,_RTC_GPIO0)
ESP.IO39: MOD1.5(GPIO39,_SENSOR_VN,_ADC1_CH3,_ADC_H,_RTC_GPIO3)
ESP.RESET: C8.1 MOD1.3(EN) P13.1 P16.3 R8.2 SW2.1 T1.3(D) ; port ESP.RESET
ESP.RXD0: MOD1.34(GPIO3,_U0RXD,_CLK_OUT2) P13.5 P16.4 R14.2 R26.2
ESP.TXD0: MOD1.35(GPIO1,_U0TXD,_CLK_OUT3,_EMAC_RXD2) P13.3 P16.5 R15.2 R20.2
USB.D_n: U13.6(USBDM) ; port USB.D_n
USB.D_p: U13.5(USBDP) ; port USB.D_p
NetD3_2: D3.2(K) R20.1
NetD4_2: D4.2(K) R26.1
NetD7_2: D7.2(K) R13.1
NetD10_2: D10.2(K) R16.1

Not connected (* = marked no-connect by the designer): MOD1 32(NC)*; P16 2; U13 7(N.C.) 8(N.C.) 9(~{CTS})* 10(~{DSR})* 11(~{RI})* 12(~{DCD})* 15(R232)*

### Buses and harness runs
bus ESP.IO[0..39] = port ESP.IO[0..39]
harness USB = port USB

### Layout directives
net class POWER: 3V3_USB

### Notes on the sheet
- (near P16) Program Header
- (near P13) Tag-Connect
- BOOT
- U0TXD
- DL
- Tx
- ESP.DOWNLOAD
- (near MOD1) 260mA
- (near MOD1) SPICLK
- U0RXD
- GPIO2
- (near MOD1) GPIO4
- (near MOD1) GPIO5
- IR In
- Rx
- DNU
- PIXEL.0
- PIXEL.1
- (near MOD1) SPIQ
- (near MOD1) SPID
- (near MOD1) SPIHD
- (near MOD1) SPIWP
- (near MOD1) SPICS0
- Combined with internal flash
- (near MOD1) U2RXD
- (near MOD1) GPIO12
- (near MOD1) GPIO13
- (near MOD1) GPIO14
- (near MOD1) GPIO15
- DEBUG LED
- DMX Tx
- PIXEL.2
- PIXEL.3
- MTDI do not pull high, internal pull-down
- MTDO, internal pull-up
- Combined with internal PSRAM
- (near MOD1) SDA
- (near MOD1) SCL
- (near MOD1) VSPICLK
- (near MOD1) VSPIQ
- (near MOD1) U2TXD
- I²C SDA
- I²C SCL
- DMX REn
- DMX TEn
- I²S WS
- I²S SD
- USB Interface
- (near MOD1) VSPID
- (near MOD1) GPIO25
- (near MOD1) GPIO26
- (near MOD1) GPIO27
- (near MOD1) GPIO32
- DMX Rx
- I²S SCK
- PIXEL.4
- PIXEL.5
- PIXEL.6
- (near MOD1) GPIO34
- (near MOD1) GPIO35
- (near MOD1) GPIO36
- (near MOD1) GPIO39
- (near MOD1) GPIO33
- MODE 1
- MODE 2
- MODE 3
- MODE 4
- PIXEL.7
- Input only
- USB UART
- CH340C
- (near SW3) Boot
- Title
- Revision
- Date
- Dranw By
- Size
- A3
- Sheet
- of

### Library data of the parts
C8 C9 C13 C21 = CAP # 100nF 16V 0603: Capacitor Ceramic; Supplier 1: LCSC; Supplier 3: Generic; Supplier Part Number 1: C282519; Supplier Part Number 3: 100nF 16V 0603 X7R
C10 C14 C22 = CAP # 10uF 10V 0805: Capacitor Ceramic; Supplier 1: Farnell; Supplier Part Number 1: 2320859; Supplier 2: LCSC; Supplier 3: Generic; Supplier Part Number 2: C17024; Supplier Part Number 3: 10uF 10V 0805 X7R
D3 = LED # Red 0805: =Description; Supplier 1: Farnell; Supplier Part Number 1: 2099236; Supplier 2: LCSC; Supplier Part Number 2: C965812
D4 D7 D10 = LED # Green 0805: =Description; Supplier 1: Farnell; Supplier Part Number 1: 2099239; Supplier 2: LCSC; Supplier Part Number 2: C965815
MOD1 = WiFi # MOD ESP-WROVER-32: Value: ESP-WROVER-32; Supplier 1: Espressif; Supplier Part Number 1: ESP-WROVER-32
P13 = HDR # TC2030: Value: TC2030; Supplier 1: NO PART
P16 = Pin Header 2.54mm 6way
R7 R8 = RES # 5K1 0603: Supplier 1: Farnell; Supplier Part Number 1: 2845922; Supplier 2: LCSC; Supplier 3: Generic; Supplier Part Number 2: C112314; Supplier Part Number 3: 5K1 1% 0603
R13 R16 R20 R26 = RES # 5k1 0603: Supplier 1: Farnell; Supplier Part Number 1: 2845922; Supplier 2: LCSC; Supplier Part Number 2: C112314; Supplier 3: Generic; Supplier Part Number 3: 5K1 1% 0603
  R20 R26: Description: RES # 5K1 0603
R14 R15 = RES # 100R 0603: Supplier 1: Farnell; Supplier 2: LCSC; Supplier 3: Generic; Supplier Part Number 1: 2446544; Supplier Part Number 2: C22775; Supplier Part Number 3: 100R 1% 0603
SW2 SW3 = SW # TACT small 4.5x4.5mm SMD WS-TASV: Value: 430181038816; Supplier 1: Wurth; Supplier 2: Mouser; Supplier 3: LCSC; Supplier Part Number 1: 430181038816; Supplier Part Number 2: 710-430181038816; Supplier Part Number 3: C174049
T1 T2 = BSS138 N-Ch MOSFET 0.2A 3.2Vgs 60Vds: Value: BSS138; Supplier 1: Farnell; Supplier Part Number 1: 2432717
U13 = CH340C # UCB UART: =Description; Value: CH340C; Supplier 1: LCSC; Supplier Part Number 1: C84681

## Nets that join several sheets
3V3_ESP: Fri3D_IRA_02 (5 pins), Fri3D_IRA_Peripherals (C7.1 D2.3 D6.3), Fri3D_IRA_Power (C19.1 U6.5), Fri3D_IRA_ESP32 (13 pins)
+5VIN: Fri3D_IRA_02 (P5.3 P9.2), Fri3D_IRA_Power (6 pins)
+12VIN: Fri3D_IRA_02 (M1.1 P5.1), Fri3D_IRA_Power (C6.1 D1.C U7.1)
GND: Fri3D_IRA_02 (27 pins), Fri3D_IRA_Peripherals (32 pins), Fri3D_IRA_Power (7 pins), Fri3D_IRA_ESP32 (17 pins)
VSYS: Fri3D_IRA_Peripherals (19 pins), Fri3D_IRA_Power (6 pins)
VUSB: Fri3D_IRA_02 (J1.A4 J1.A9 J1.B4 J1.B9), Fri3D_IRA_Power (D13.A T6.1)
DMX.A: Fri3D_IRA_02 (P6.2), Fri3D_IRA_Peripherals (P14.2 P15.2 U5.6)
DMX.B: Fri3D_IRA_02 (P6.3), Fri3D_IRA_Peripherals (R19.2 U5.7)
DMX.REn: Fri3D_IRA_Peripherals (U5.2), Fri3D_IRA_ESP32 (MOD1.30)
DMX.RX: Fri3D_IRA_Peripherals (R1.2 R4.1), Fri3D_IRA_ESP32 (MOD1.37)
DMX.TE: Fri3D_IRA_Peripherals (U5.3), Fri3D_IRA_ESP32 (MOD1.31)
DMX.TX: Fri3D_IRA_Peripherals (R18.1 U3.2), Fri3D_IRA_ESP32 (MOD1.16)
ESP.IO2: Fri3D_IRA_Peripherals (U2.2), Fri3D_IRA_ESP32 (MOD1.24)
ESP.IO4: Fri3D_IRA_Peripherals (U4.2), Fri3D_IRA_ESP32 (MOD1.26)
ESP.IO5: Fri3D_IRA_Peripherals (D2.1 D6.1), Fri3D_IRA_ESP32 (MOD1.29)
ESP.IO12: Fri3D_IRA_Peripherals (U9.2), Fri3D_IRA_ESP32 (MOD1.14)
ESP.IO14: Fri3D_IRA_Peripherals (U10.2), Fri3D_IRA_ESP32 (MOD1.13)
ESP.IO21: Fri3D_IRA_02 (P7.2), Fri3D_IRA_ESP32 (MOD1.33)
ESP.IO22: Fri3D_IRA_02 (P7.4), Fri3D_IRA_ESP32 (MOD1.36)
ESP.IO25: Fri3D_IRA_Peripherals (U11.2), Fri3D_IRA_ESP32 (MOD1.10)
ESP.IO26: Fri3D_IRA_02 (P7.3), Fri3D_IRA_ESP32 (MOD1.11)
ESP.IO27: Fri3D_IRA_Peripherals (U12.2), Fri3D_IRA_ESP32 (MOD1.12)
ESP.IO32: Fri3D_IRA_Peripherals (U1.2), Fri3D_IRA_ESP32 (MOD1.8)
ESP.IO33: Fri3D_IRA_Peripherals (U8.2), Fri3D_IRA_ESP32 (MOD1.9)
ESP.IO34: Fri3D_IRA_02 (P3.4 P12.4 P17.2 R11.2), Fri3D_IRA_ESP32 (MOD1.6)
ESP.IO35: Fri3D_IRA_02 (P3.2 P11.2 P12.2 R6.2), Fri3D_IRA_ESP32 (MOD1.7)
ESP.IO36: Fri3D_IRA_02 (P3.8 P12.8 P19.2 R17.2), Fri3D_IRA_ESP32 (MOD1.4)
ESP.IO39: Fri3D_IRA_02 (P3.6 P12.6 P18.2 R12.2), Fri3D_IRA_ESP32 (MOD1.5)
LED.DOUT0: Fri3D_IRA_02 (P4.3), Fri3D_IRA_Peripherals (R2.2)
LED.DOUT1: Fri3D_IRA_02 (P4.2), Fri3D_IRA_Peripherals (R3.2)
LED.DOUT2: Fri3D_IRA_02 (P4.1), Fri3D_IRA_Peripherals (R22.2)
LED.DOUT3: Fri3D_IRA_02 (P1.2 P8.3), Fri3D_IRA_Peripherals (R23.2)
LED.DOUT4: Fri3D_IRA_02 (P1.1 P8.2), Fri3D_IRA_Peripherals (R24.2)
LED.DOUT5: Fri3D_IRA_02 (P8.1), Fri3D_IRA_Peripherals (R25.2)
LED.DOUT6: Fri3D_IRA_02 (P10.2), Fri3D_IRA_Peripherals (R9.2)
LED.DOUT7: Fri3D_IRA_02 (P10.1), Fri3D_IRA_Peripherals (R10.2)
USB.D_n: Fri3D_IRA_02 (J1.A7 J1.B7), Fri3D_IRA_ESP32 (U13.6)
USB.D_p: Fri3D_IRA_02 (J1.A6 J1.B6), Fri3D_IRA_ESP32 (U13.5)

## Assembly variants
Default: not fitted C5 C13 C14 C21 C22 D3 D4 D6 J1 M1 M2 P1 P3 P6 P7 P9 P14 P15 P16 R1 R4 R5 R14 R15 R18 R19 R20 R21 R26 R27 R28 SW2 SW3 T1 T2 U3 U5 U13
Minimal: not fitted C1 C2 C3 C4 C5 C6 C11 C12 C13 C14 C15 C20 C21 C22 D1 D3 D4 D6 D13 J1 M1 M2 P3 P4 P5 P6 P7 P8 P10 P14 P15 P16 R1 R2 R3 R4 R5 R9 R10 R14 R15 R18 R19 R20 R22 R25 R26 R27 R28 SW2 SW3 T1 T2 T6 U1 U2 U3 U4 U5 U7 U8 U9 U12 U13
Development: not fitted D6 P1 P3 P9 P13 P16 R18 R21
Minimal_DMX: not fitted C1 C2 C3 C4 C6 C11 C12 C13 C14 C15 C20 C21 C22 D1 D3 D4 D6 D13 J1 M1 M2 P3 P4 P5 P7 P8 P10 P16 R1 R2 R3 R4 R5 R9 R10 R14 R15 R18 R20 R22 R25 R26 R27 R28 SW2 SW3 T1 T2 T6 U1 U2 U4 U7 U8 U9 U12 U13
Default_DMX: not fitted C13 C14 C21 C22 D3 D4 D6 J1 M1 M2 P1 P3 P7 P9 P16 R1 R4 R5 R14 R15 R18 R20 R21 R26 R27 R28 SW2 SW3 T1 T2 U13